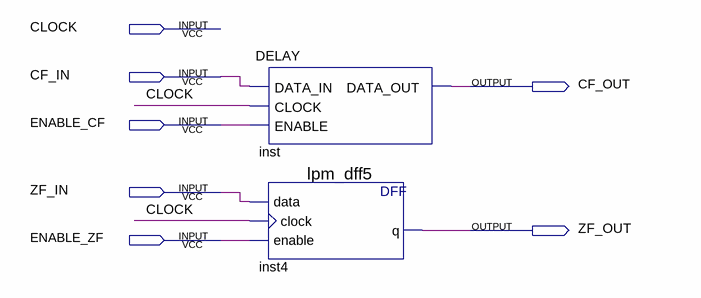
[diagram p0: schematic sheet]
// Quartus schematic FLAG_REGISTER.bdf as structural Verilog: 2 symbols, 7 pins
module FLAG_REGISTER (
  input  CLOCK,
  input  CF_IN,
  input  ENABLE_CF,
  input  ZF_IN,
  input  ENABLE_ZF,
  output CF_OUT,
  output ZF_OUT
);

  DELAY inst (.DATA_IN(CF_IN), .CLOCK(CLOCK), .ENABLE(ENABLE_CF), .DATA_OUT(CF_OUT));
  lpm_dff5 inst4 (.data(ZF_IN), .clock(CLOCK), .enable(ENABLE_ZF), .q(ZF_OUT));
endmodule
